# EAGLE design uRings_SE_Main_Board (EAGLE 9.6.2)
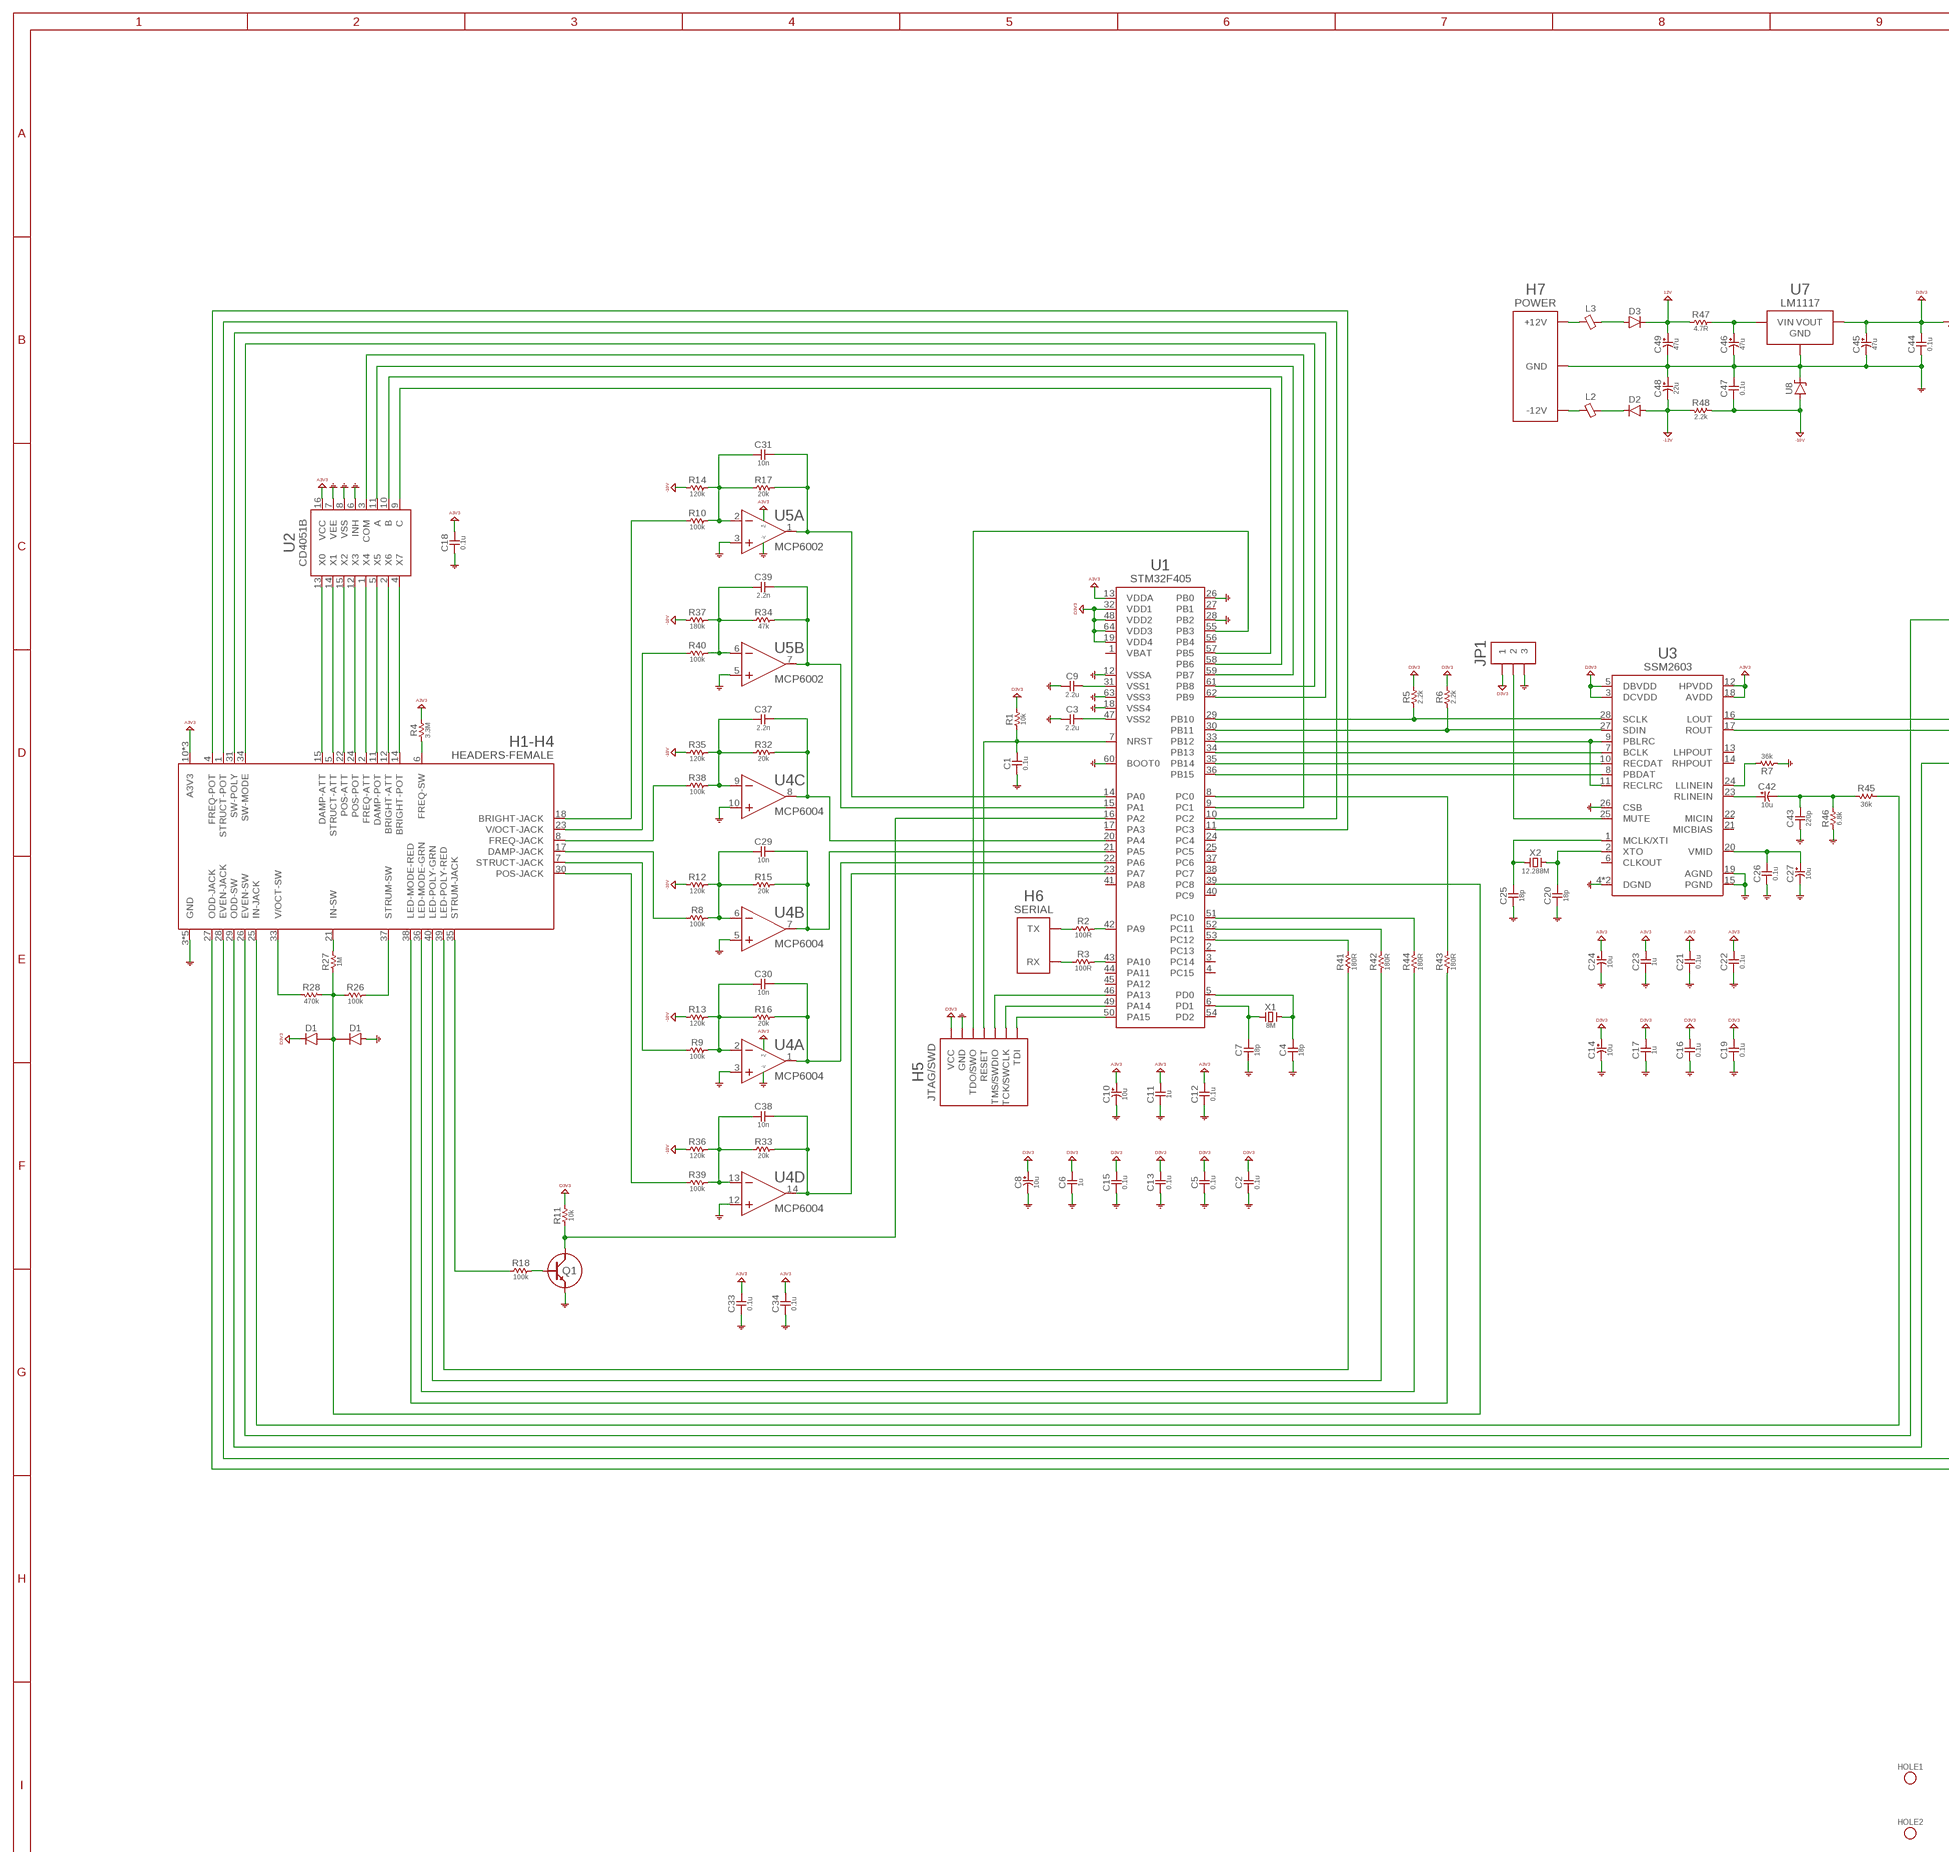
[diagram p0: schematic, sheet 1, part 1 of 2]
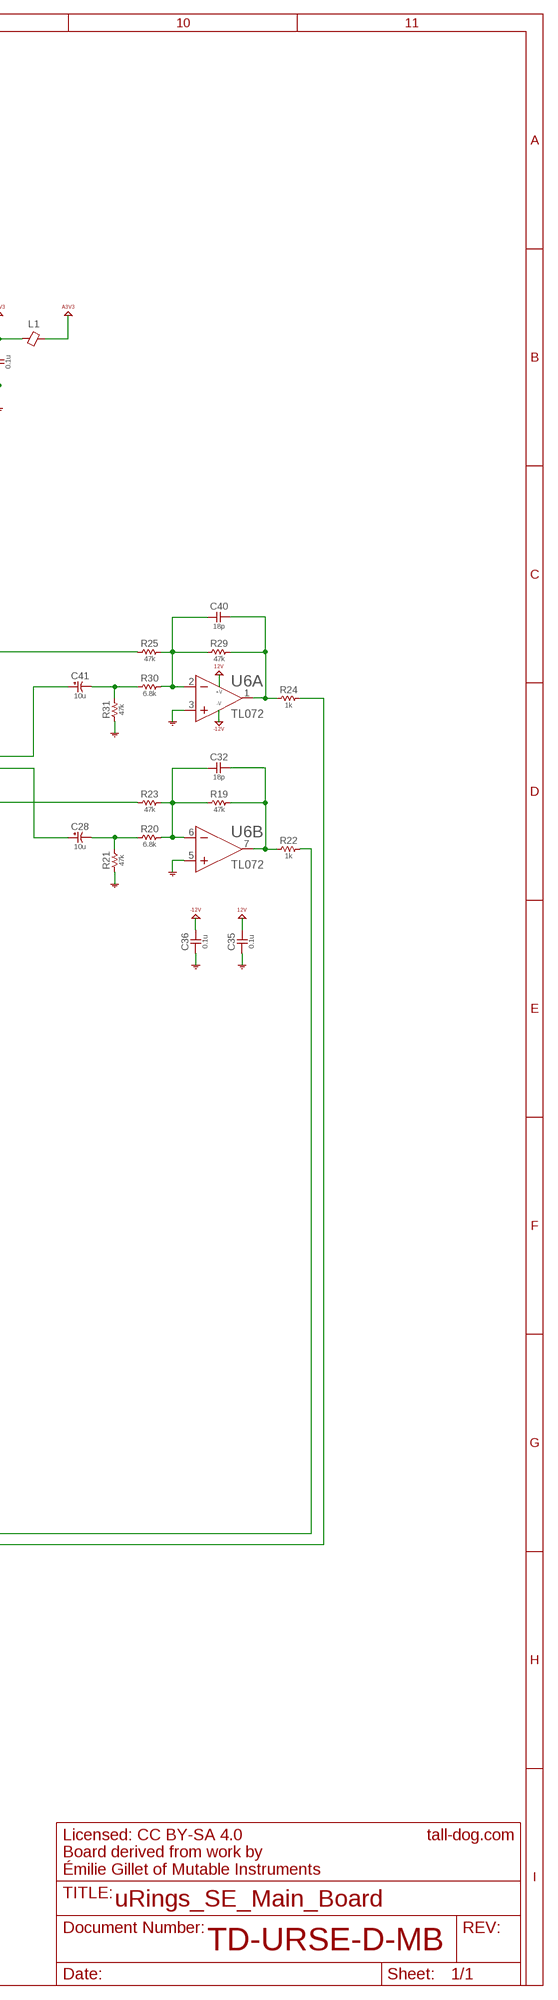
[diagram p1: schematic, sheet 1, part 2 of 2]

## Parts
C1  0.1u  CAP-NP-0603  [0603-NP]
C2  0.1u  CAP-NP-0603  [0603-NP]
C3  2.2u  CAP-NP-0603  [0603-NP]
C4  18p  CAP-NP-0603  [0603-NP]
C5  0.1u  CAP-NP-0603  [0603-NP]
C6  1u  CAP-NP-0603  [0603-NP]
C7  18p  CAP-NP-0603  [0603-NP]
C8  10u  CAP-P-4.3MM  [ELECTRO-SMD-4.3MM]
C9  2.2u  CAP-NP-0603  [0603-NP]
C10  10u  CAP-P-4.3MM  [ELECTRO-SMD-4.3MM]
C11  1u  CAP-NP-0603  [0603-NP]
C12  0.1u  CAP-NP-0603  [0603-NP]
C13  0.1u  CAP-NP-0603  [0603-NP]
C14  10u  CAP-P-4.3MM  [ELECTRO-SMD-4.3MM]
C15  0.1u  CAP-NP-0603  [0603-NP]
C16  0.1u  CAP-NP-0603  [0603-NP]
C17  1u  CAP-NP-0603  [0603-NP]
C18  0.1u  CAP-NP-0603  [0603-NP]
C19  0.1u  CAP-NP-0603  [0603-NP]
C20  18p  CAP-NP-0603  [0603-NP]
C21  0.1u  CAP-NP-0603  [0603-NP]
C22  0.1u  CAP-NP-0603  [0603-NP]
C23  1u  CAP-NP-0603  [0603-NP]
C24  10u  CAP-P-4.3MM  [ELECTRO-SMD-4.3MM]
C25  18p  CAP-NP-0603  [0603-NP]
C26  0.1u  CAP-NP-0603  [0603-NP]
C27  10u  CAP-P-4.3MM  [ELECTRO-SMD-4.3MM]
C28  10u  CAP-P-4.3MM  [ELECTRO-SMD-4.3MM]
C29  10n  CAP-NP-0603  [0603-NP]
C30  10n  CAP-NP-0603  [0603-NP]
C31  10n  CAP-NP-0603  [0603-NP]
C32  18p  CAP-NP-0603  [0603-NP]
C33  0.1u  CAP-NP-0603  [0603-NP]
C34  0.1u  CAP-NP-0603  [0603-NP]
C35  0.1u  CAP-NP-0603  [0603-NP]
C36  0.1u  CAP-NP-0603  [0603-NP]
C37  2.2n  CAP-NP-0603  [0603-NP]
C38  10n  CAP-NP-0603  [0603-NP]
C39  2.2n  CAP-NP-0603  [0603-NP]
C40  18p  CAP-NP-0603  [0603-NP]
C41  10u  CAP-P-4.3MM  [ELECTRO-SMD-4.3MM]
C42  10u  CAP-P-4.3MM  [ELECTRO-SMD-4.3MM]
C43  220p  CAP-NP-0603  [0603-NP]
C44  0.1u  CAP-NP-0603  [0603-NP]
C45  47u  CAP-P-6.6MM  [ELECTRO-SMD-6.6MM]
C46  47u  CAP-P-6.6MM  [ELECTRO-SMD-6.6MM]
C47  0.1u  CAP-NP-0603  [0603-NP]
C48  22u  CAP-P-6.6MM  [ELECTRO-SMD-6.6MM]
C49  47u  CAP-P-6.6MM  [ELECTRO-SMD-6.6MM]
D1  DIODE-DUAL  [SOT-23]
D2  DIODE  [SOD-123]
D3  DIODE  [SOD-123]
H1-H4  HEADERS-FEMALE  [HEADERS-FEMALE]
H5  JTAG/SWD  [PTH-0.05-2X5-SHROUDED]
H6  SERIAL  [SERIAL]
H7  POWER  [PTH-0.1-2X5-SHROUDED]
HOLE1  HOLE  [M2.5-HOLE]
HOLE2  HOLE  [M2.5-HOLE]
JP1  JUMPER-3  [JUMPER-3]
L1  FERRITE-BEAD-0603  [0603-NP]
L2  FERRITE-BEAD-0603  [0603-NP]
L3  FERRITE-BEAD-0603  [0603-NP]
Q1  NPN  [SOT-23]
R1  10k  RESISTOR-0603  [0603-NP]
R2  100R  RESISTOR-0603  [0603-NP]
R3  100R  RESISTOR-0603  [0603-NP]
R4  3.3M  RESISTOR-1206  [1206-NP]
R5  2.2k  RESISTOR-0603  [0603-NP]
R6  2.2k  RESISTOR-0603  [0603-NP]
R7  36k  RESISTOR-0603  [0603-NP]
R8  100k  RESISTOR-0603  [0603-NP]
R9  100k  RESISTOR-0603  [0603-NP]
R10  100k  RESISTOR-0603  [0603-NP]
R11  10k  RESISTOR-0603  [0603-NP]
R12  120k  RESISTOR-0603  [0603-NP]
R13  120k  RESISTOR-0603  [0603-NP]
R14  120k  RESISTOR-0603  [0603-NP]
R15  20k  RESISTOR-0603  [0603-NP]
R16  20k  RESISTOR-0603  [0603-NP]
R17  20k  RESISTOR-0603  [0603-NP]
R18  100k  RESISTOR-0603  [0603-NP]
R19  47k  RESISTOR-0603  [0603-NP]
R20  6.8k  RESISTOR-0603  [0603-NP]
R21  47k  RESISTOR-0603  [0603-NP]
R22  1k  RESISTOR-0603  [0603-NP]
R23  47k  RESISTOR-0603  [0603-NP]
R24  1k  RESISTOR-0603  [0603-NP]
R25  47k  RESISTOR-0603  [0603-NP]
R26  100k  RESISTOR-0603  [0603-NP]
R27  1M  RESISTOR-1206  [1206-NP]
R28  470k  RESISTOR-1206  [1206-NP]
R29  47k  RESISTOR-0603  [0603-NP]
R30  6.8k  RESISTOR-0603  [0603-NP]
R31  47k  RESISTOR-0603  [0603-NP]
R32  20k  RESISTOR-0603  [0603-NP]
R33  20k  RESISTOR-0603  [0603-NP]
R34  47k  RESISTOR-0603  [0603-NP]
R35  120k  RESISTOR-0603  [0603-NP]
R36  120k  RESISTOR-0603  [0603-NP]
R37  180k  RESISTOR-0603  [0603-NP]
R38  100k  RESISTOR-0603  [0603-NP]
R39  100k  RESISTOR-0603  [0603-NP]
R40  100k  RESISTOR-0603  [0603-NP]
R41  180R  RESISTOR-0603  [0603-NP]
R42  180R  RESISTOR-0603  [0603-NP]
R43  180R  RESISTOR-0603  [0603-NP]
R44  180R  RESISTOR-0603  [0603-NP]
R45  36k  RESISTOR-0603  [0603-NP]
R46  6.8k  RESISTOR-0603  [0603-NP]
R47  4.7R  RESISTOR-1206  [1206-NP]
R48  2.2k  RESISTOR-0603  [0603-NP]
U1  STM32F405  [LQFP-64]
U2  CD4051B  [TSSOP-16]
U3  SSM2603  [QFN-28]
U4  MCP6004  [TSSOP-14]
U5  MCP6002  [MSOP-8]
U6  TL072  [TSSOP-8]
U7  LM1117  [SOT-223]
U8  ZENER  [SOT-23]
X1  8M  CRYSTAL  [CRYSTAL-ABM3]
X2  12.288M  CRYSTAL  [CRYSTAL-ABM3]

## Nets
12V: C35.2 C49.A(POS) D3.C R47.1 U6.8(A:POS)
-10V: C47.2 R12.1 R13.1 R14.1 R35.1 R36.1 R37.1 R48.1 U8.2(A)
-12V: C36.1 C48.C(NEG) D2.A R48.2 U6.4(A:NEG)
A3V3: C10.A(POS) C11.2 C12.2 C18.2 C21.2 C22.2 C23.2 C24.A(POS) C33.2 C34.2 H1-H4.10(A3V3) H1-H4.16(A3V3) H1-H4.20(A3V3) L1.2 R4.2 U1.13(VDDA) U2.16(VCC) U3.12(HPVDD) U3.18(AVDD) U4.4(A:POS) U5.8(A:POS)
BRIGHT-ATT: H1-H4.12(BRIGHT-ATT) U2.2(X6)
BRIGHT-CV: C31.2 R17.2 U1.14(PA0) U5.1(A:OUT)
BRIGHT-JACK: H1-H4.18(BRIGHT-JACK) R10.1
BRIGHT-POT: H1-H4.14(BRIGHT-POT) U2.4(X7)
D3V3: C2.2 C5.2 C6.2 C8.A(POS) C13.2 C14.A(POS) C15.2 C16.2 C17.2 C19.2 C44.2 C45.A(POS) D1.2(C2) H5.1(VCC) JP1.1 L1.1 R1.2 R5.2 R6.2 R11.2 U1.19(VDD4) U1.32(VDD1) U1.48(VDD2) U1.64(VDD3) U3.3(DCVDD) U3.5(DBVDD) U7.2(VOUT) U7.4(VOUT)
DAMP-ATT: H1-H4.15(DAMP-ATT) U2.13(X0)
DAMP-CV: C29.2 R15.2 U1.21(PA5) U4.7(B:OUT)
DAMP-JACK: H1-H4.17(DAMP-JACK) R8.1
DAMP-POT: H1-H4.11(DAMP-POT) U2.5(X5)
EVEN-JACK: H1-H4.28(EVEN-JACK) R22.2
EVEN-OUT: C28.A(POS) U3.17(ROUT)
EVEN-SW: H1-H4.26(EVEN-SW) R25.1
FREQ-ATT: H1-H4.2(FREQ-ATT) U2.1(X4)
FREQ-CV: C37.2 R32.2 U1.20(PA4) U4.8(C:OUT)
FREQ-JACK: H1-H4.8(FREQ-JACK) R38.1
FREQ-POT: H1-H4.4(FREQ-POT) U1.11(PC3)
GND: C1.1 C2.1 C3.1 C4.2 C5.1 C6.1 C7.2 C8.C(NEG) C9.1 C10.C(NEG) C11.1 C12.1 C13.1 C14.C(NEG) C15.1 C16.1 C17.1 C18.1 C19.1 C20.1 C21.1 C22.1 C23.1 C24.C(NEG) C25.1 C26.1 C27.C(NEG) C33.1 C34.1 C35.1 C36.2 C43.1 C44.1 C45.C(NEG) C46.C(NEG) C47.1 C48.A(POS) C49.C(NEG) D1.1(A1) H1-H4.3(GND) H1-H4.9(GND) H1-H4.13(GND) H1-H4.19(GND) H1-H4.32(GND) H5.3(GND) H5.5(GND) H5.9(GND) H7.3(GND) H7.4(GND) H7.5(GND) H7.6(GND) H7.7(GND) H7.8(GND) JP1.3 Q1.2(E) R7.1 R21.1 R31.1 R46.1 U1.12(VSSA) U1.18(VSS4) U1.26(PB0) U1.28(PB2) U1.60(BOOT0) U1.63(VSS3) U2.6(INH) U2.7(VEE) U2.8(VSS) U3.4(DGND) U3.15(PGND) U3.19(AGND) U3.26(CSB) U3.29(DGND) U4.3(A:IN+) U4.5(B:+) U4.10(C:+) U4.11(A:NEG) U4.12(D:+) U5.3(A:IN+) U5.4(A:NEG) U5.5(B:+) U6.3(A:IN+) U6.5(B:+) U7.1(GND) U8.1(C)
I2C-SCL: R5.1 U1.29(PB10) U3.28(SCLK)
I2C-SDA: R6.1 U1.30(PB11) U3.27(SDIN)
I2S-LRCK: U1.33(PB12) U3.9(PBLRC) U3.11(RECLRC)
I2S-SCK: U1.34(PB13) U3.7(BCLK)
I2S-SIN: U1.35(PB14) U3.10(RECDAT)
I2S-SOUT: U1.36(PB15) U3.8(PBDAT)
IN: C42.A(POS) U3.23(RLINEIN)
IN-JACK: H1-H4.25(IN-JACK) R45.1
IN-SW: H1-H4.21(IN-SW) R27.2
JTCK/SWCLK: H5.4(TCK/SWCLK) U1.49(PA14)
JTDI: H5.8(TDI) U1.50(PA15)
JTDO/SWO: H5.6(TDO/SWO) U1.55(PB3)
JTMS/SWDIO: H5.2(TMS/SWDIO) U1.46(PA13)
LED-MODE-GRN: H1-H4.36(LED-MODE-GRN) R44.2
LED-MODE-RED: H1-H4.38(LED-MODE-RED) R43.2
LED-POLY-GRN: H1-H4.40(LED-POLY-GRN) R42.2
LED-POLY-RED: H1-H4.39(LED-POLY-RED) R41.2
MUTE: JP1.2 U3.25(MUTE)
MUX-ADDR-0: U1.59(PB7) U2.11(A)
MUX-ADDR-1: U1.58(PB6) U2.10(B)
MUX-ADDR-2: U1.57(PB5) U2.9(C)
MUXED-POTS: U1.9(PC1) U2.3(COM)
N$1: R43.1 U1.8(PC0)
N$2: C46.A(POS) R47.2 U7.3(VIN)
N$3: D3.A L3.1
N$4: D2.C L2.1
N$5: C29.1 R8.2 R12.2 R15.1 U4.6(B:-)
N$6: R44.1 U1.51(PC10)
N$7: C9.2 U1.31(VSS1)
N$8: C3.2 U1.47(VSS2)
N$9: R42.1 U1.52(PC11)
N$10: R41.1 U1.53(PC12)
N$11: C4.1 U1.5(PD0) X1.2
N$12: C7.1 U1.6(PD1) X1.1
N$13: C31.1 R10.2 R14.2 R17.1 U5.2(A:IN-)
N$14: C39.1 R34.1 R37.2 R40.2 U5.6(B:-)
N$15: C37.1 R32.1 R35.2 R38.2 U4.9(C:-)
N$16: C30.1 R9.2 R13.2 R16.1 U4.2(A:IN-)
N$17: C38.1 R33.1 R36.2 R39.2 U4.13(D:-)
N$18: C28.C(NEG) R20.1 R21.2
N$19: C42.C(NEG) C43.2 R45.2 R46.2
N$20: C41.C(NEG) R30.1 R31.2
N$21: Q1.1(B) R18.2
N$22: C25.2 U3.1(MCLK/XTI) X2.2
N$23: C20.2 U3.2(XTO) X2.1
N$24: C32.1 R19.1 R20.2 R23.2 U6.6(B:-)
N$25: C32.2 R19.2 R22.1 U6.7(B:OUT)
N$26: C40.1 R25.2 R29.1 R30.2 U6.2(A:IN-)
N$27: C26.2 C27.A(POS) U3.20(VMID)
N$28: R7.2 U3.24(LLINEIN)
N$29: C40.2 R24.1 R29.2 U6.1(A:OUT)
N$30: H1-H4.6(FREQ-SW) R4.1
N$100: H7.1(-12V) H7.2(-12V) L2.2
N$101: H7.9(+12V) H7.10(+12V) L3.2
NORM-PROBE: D1.3(C1/A2) R26.1 R27.1 R28.1 U1.39(PC8)
ODD-JACK: H1-H4.27(ODD-JACK) R24.2
ODD-OUT: C41.A(POS) U3.16(LOUT)
ODD-SW: H1-H4.29(ODD-SW) R23.1
POS-ATT: H1-H4.22(POS-ATT) U2.15(X2)
POS-CV: C38.2 R33.2 U1.23(PA7) U4.14(D:OUT)
POS-JACK: H1-H4.30(POS-JACK) R39.1
POS-POT: H1-H4.24(POS-POT) U2.12(X3)
RESET: C1.2 H5.10(RESET) R1.1 U1.7(NRST)
RX: H6.RX R3.1
RX1: R3.2 U1.43(PA10)
STRUCT-ATT: H1-H4.5(STRUCT-ATT) U2.14(X1)
STRUCT-CV: C30.2 R16.2 U1.22(PA6) U4.1(A:OUT)
STRUCT-JACK: H1-H4.7(STRUCT-JACK) R9.1
STRUCT-POT: H1-H4.1(STRUCT-POT) U1.10(PC2)
STRUM: Q1.3(C) R11.1 U1.16(PA2)
STRUM-JACK: H1-H4.35(STRUM-JACK) R18.1
STRUM-SW: H1-H4.37(STRUM-SW) R26.2
SW-MODE: H1-H4.34(SW-MODE) U1.61(PB8)
SW-POLY: H1-H4.31(SW-POLY) U1.62(PB9)
TX: H6.TX R2.1
TX1: R2.2 U1.42(PA9)
V/OCT-CV: C39.2 R34.2 U1.15(PA1) U5.7(B:OUT)
V/OCT-JACK: H1-H4.23(V/OCT-JACK) R40.1
V/OCT-SW: H1-H4.33(V/OCT-SW) R28.2
Unconnected: HOLE1.P$1 HOLE1.P$2 HOLE1.P$3 HOLE1.P$4 HOLE1.P$5 HOLE1.P$6 HOLE1.P$7 HOLE1.P$8 HOLE1.P$9 HOLE2.P$1 HOLE2.P$2 HOLE2.P$3 HOLE2.P$4 HOLE2.P$5 HOLE2.P$6 HOLE2.P$7 HOLE2.P$8 HOLE2.P$9 U1.1(VBAT) U1.2(PC13) U1.3(PC14) U1.4(PC15) U1.17(PA3) U1.24(PC4) U1.25(PC5) U1.27(PB1) U1.37(PC6) U1.38(PC7) U1.40(PC9) U1.41(PA8) U1.44(PA11) U1.45(PA12) U1.54(PD2) U1.56(PB4) U3.6(CLKOUT) U3.13(LHPOUT) U3.14(RHPOUT) U3.21(MICBIAS) U3.22(MICIN)

## Notes on the sheet
- tall-dog.com
- Licensed: CC BY-SA 4.0
  Board derived from work by
  Émilie Gillet of Mutable Instruments
- TD-URSE-D-MB

## Library data of the parts
C1-C7 C9 C11-C13 C15-C23 C25 C26 C29-C40 C43 C44 C47 = uRings_SE_Library:CAP-NP
C8 C10 C14 C24 C27 C28 C41 C42 C45 C46 C48 C49 = uRings_SE_Library:CAP-P
D1 = uRings_SE_Library:DIODE-DUAL
D2 D3 = uRings_SE_Library:DIODE
H1-H4 = uRings_SE_Library:HEADERS-FEMALE
H5 = uRings_SE_Library:JTAG/SWD
H6 = uRings_SE_Library:SERIAL
H7 = uRings_SE_Library:POWER
HOLE1 HOLE2 = uRings_SE_Library:HOLE
JP1 = uRings_SE_Library:JUMPER-3
L1-L3 = uRings_SE_Library:FERRITE-BEAD
Q1 = uRings_SE_Library:NPN
R1-R48 = uRings_SE_Library:RESISTOR
U1 = uRings_SE_Library:STM32F405
U2 = uRings_SE_Library:CD4051B
U3 = uRings_SE_Library:SSM2603
U4 = uRings_SE_Library:MCP6004
U5 = uRings_SE_Library:MCP6002
U6 = uRings_SE_Library:TL072: OP AMP
U7 = uRings_SE_Library:LM1117: 800mA and 1A Low Dropout (LDO) Positive Regulator 1.8V, 2.5V, 2.85V, 3.3V, 5V, and Adj
U8 = uRings_SE_Library:ZENER: PRECISION MICROPOWER SHUNT VOLTAGE REFERENCE Source: http://focus.ti.com/lit/ds/slcs146e/slcs146e.pdf
X1 X2 = uRings_SE_Library:CRYSTAL

## Board
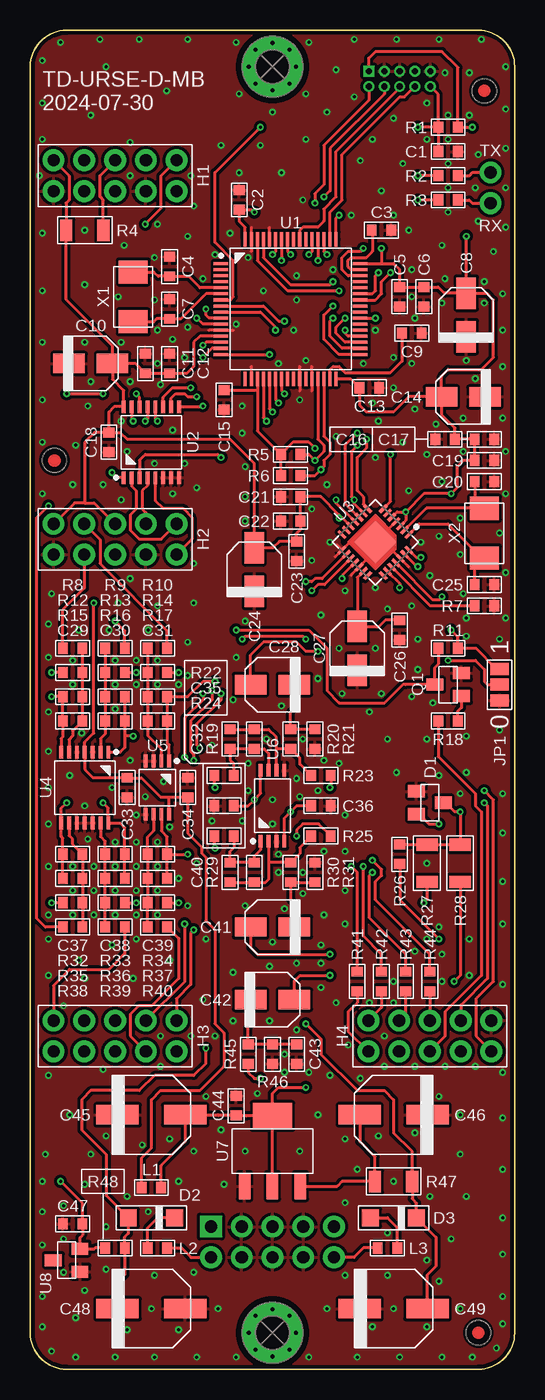
[diagram p2: board, top side]
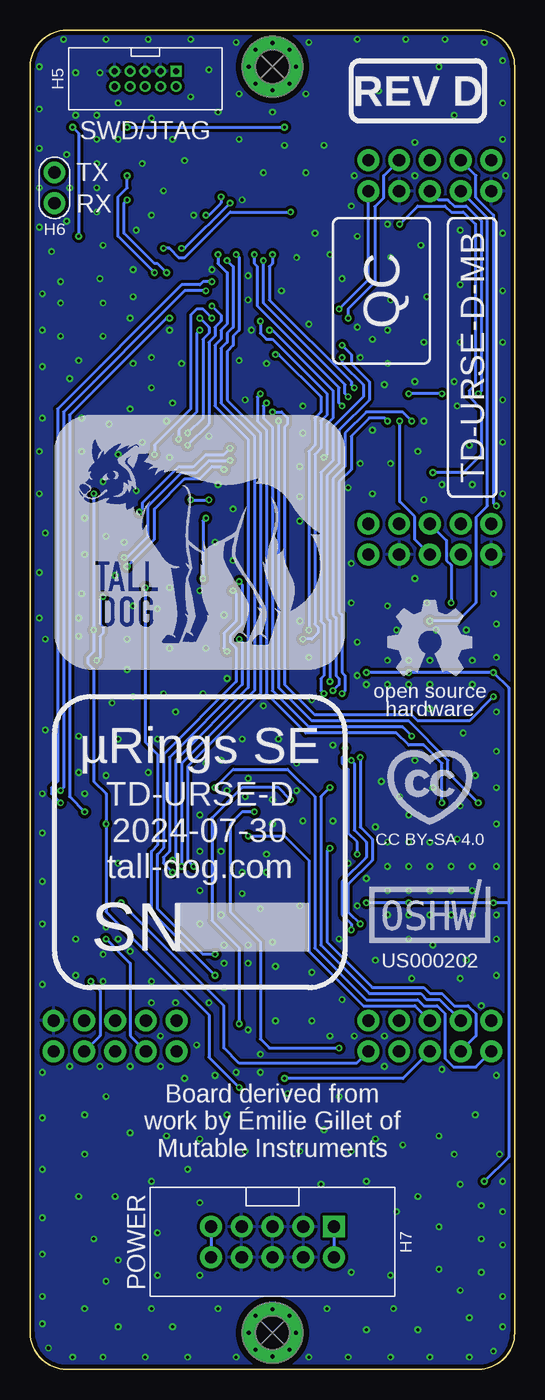
[diagram p3: board, bottom side, seen from below]

Size 40 x 110.5 mm. Coordinates in mm from the lower left corner, seen from the top.
Outline: 3,0 37,0 arc90 40,3 40,107.5 arc90 37,110.5 3,110.5 arc90 0,107.5 0,3 arc90 3,0
Copper layers (1*16): Top 0.035mm / dielectric 1.5mm / Bottom 0.035mm
Design rules "brds *": minimum track width 0.25mm, minimum drill 0.25mm, track to track 6mil, track to pad 6mil, pad to pad 6mil, via to via 6mil, smd to smd 0mil, copper to edge 12mil, drill to drill 8mil, minimum pad ring 6mil, minimum via ring 6mil, stop-mask expansion 0mil, vias tented up to drill 0.3mm, thermal gap 10mil

### Footprints (pad centres in the part's own frame; a part is rotated, then mirrored left to right if it is on the bottom)
0603-NP = smd 0.81 x 0.93: 1 -0.81,0; 2 0.81,0
ELECTRO-SMD-4.3MM = smd 2.6 x 1.6: A 1.8,0; C -1.8,0
ELECTRO-SMD-6.6MM = smd 3.5 x 1.6: A 2.8,0; C -2.8,0
SOT-23 = smd 1 x 1.4: 1 -0.95,-1.1; 2 0.95,-1.1; 3 0,1.1
SOD-123 = smd 1.4 x 1.4: A 1.9,0; C -1.9,0
HEADERS-FEMALE = drill 1 pad 1.8: 1 12.08,97.23; 2 12.08,99.77; 3 9.54,97.23; 4 9.54,99.77; 5 7,97.23; 6 7,99.77; 7 4.46,97.23; 8 4.46,99.77; 9 1.92,97.23; 10 1.92,99.77; 11 12.08,67.23; 12 12.08,69.77; 13 9.54,67.23; 14 9.54,69.77; 15 7,67.23; 16 7,69.77; 17 4.46,67.23; 18 4.46,69.77; 19 1.92,67.23; 20 1.92,69.77; 21 12.08,26.23; 22 12.08,28.77; 23 9.54,26.23; 24 9.54,28.77; 25 7,26.23; 26 7,28.77; 27 4.46,26.23; 28 4.46,28.77; 29 1.92,26.23; 30 1.92,28.77; 31 38.08,26.23; 32 38.08,28.77; 33 35.54,26.23; 34 35.54,28.77; 35 33,26.23; 36 33,28.77; 37 30.46,26.23; 38 30.46,28.77; 39 27.92,26.23; 40 27.92,28.77
PTH-0.05-2X5-SHROUDED = drill 0.5 pad 0.9 square: 1 -0.635,2.54 | drill 0.5 pad 0.9: 2 0.635,2.54; 3 -0.635,1.27; 4 0.635,1.27; 5 -0.635,0; 6 0.635,0; 7 -0.635,-1.27; 8 0.635,-1.27; 9 -0.635,-2.54; 10 0.635,-2.54
SERIAL = drill 1.016 pad 1.778: RX 0,-1.27; TX 0,1.27
PTH-0.1-2X5-SHROUDED = drill 1 pad 1.8 square: 1 -1.27,5.08 | drill 1 pad 1.8: 2 1.27,5.08; 3 -1.27,2.54; 4 1.27,2.54; 5 -1.27,0; 6 1.27,0; 7 -1.27,-2.54; 8 1.27,-2.54; 9 -1.27,-5.08; 10 1.27,-5.08
M2.5-HOLE = drill 2.75 pad 5: P$1 0,0 | drill 0.35: P$2 0,1.95; P$3 0,-1.95; P$4 -1.95,0; P$5 1.95,0; P$6 1.4,1.4; P$7 -1.4,1.4; P$8 -1.4,-1.4; P$9 1.4,-1.4
JUMPER-3 = smd 1 x 1.5: 1 -1.3,0; 2 0,0; 3 1.3,0
1206-NP = smd 1 x 1.77: 1 -1.535,0; 2 1.535,0
LQFP-64 = smd 0.25 x 1.2: 1 -3.75,-5.75; 2 -3.25,-5.75; 3 -2.75,-5.75; 4 -2.25,-5.75; 5 -1.75,-5.75; 6 -1.25,-5.75; 7 -0.75,-5.75; 8 -0.25,-5.75; 9 0.25,-5.75; 10 0.75,-5.75; 11 1.25,-5.75; 12 1.75,-5.75; 13 2.25,-5.75; 14 2.75,-5.75; 15 3.25,-5.75; 16 3.75,-5.75; 33 3.75,5.75; 34 3.25,5.75; 35 2.75,5.75; 36 2.25,5.75; 37 1.75,5.75; 38 1.25,5.75; 39 0.75,5.75; 40 0.25,5.75; 41 -0.25,5.75; 42 -0.75,5.75; 43 -1.25,5.75; 44 -1.75,5.75; 45 -2.25,5.75; 46 -2.75,5.75; 47 -3.25,5.75; 48 -3.75,5.75 | smd 1.2 x 0.25: 17 5.75,-3.75; 18 5.75,-3.25; 19 5.75,-2.75; 20 5.75,-2.25; 21 5.75,-1.75; 22 5.75,-1.25; 23 5.75,-0.75; 24 5.75,-0.25; 25 5.75,0.25; 26 5.75,0.75; 27 5.75,1.25; 28 5.75,1.75; 29 5.75,2.25; 30 5.75,2.75; 31 5.75,3.25; 32 5.75,3.75; 49 -5.75,3.75; 50 -5.75,3.25; 51 -5.75,2.75; 52 -5.75,2.25; 53 -5.75,1.75; 54 -5.75,1.25; 55 -5.75,0.75; 56 -5.75,0.25; 57 -5.75,-0.25; 58 -5.75,-0.75; 59 -5.75,-1.25; 60 -5.75,-1.75; 61 -5.75,-2.25; 62 -5.75,-2.75; 63 -5.75,-3.25; 64 -5.75,-3.75
TSSOP-16 = smd 0.32 x 1.05: 1 -2.275,-2.925; 2 -1.625,-2.925; 3 -0.975,-2.925; 4 -0.325,-2.925; 5 0.325,-2.925; 6 0.975,-2.925; 7 1.625,-2.925; 8 2.275,-2.925; 9 2.275,2.925; 10 1.625,2.925; 11 0.975,2.925; 12 0.325,2.925; 13 -0.325,2.925; 14 -0.975,2.925; 15 -1.625,2.925; 16 -2.275,2.925
QFN-28 = smd 0.813 x 0.254: 1 -2.4,1.5; 2 -2.4,1; 3 -2.4,0.5; 4 -2.4,0; 5 -2.4,-0.5; 6 -2.4,-1; 7 -2.4,-1.5; 15 2.4,-1.5; 16 2.4,-1; 17 2.4,-0.5; 18 2.4,0; 19 2.4,0.5; 20 2.4,1; 21 2.4,1.5 | smd 0.254 x 0.813: 8 -1.5,-2.4; 9 -1,-2.4; 10 -0.5,-2.4; 11 0,-2.4; 12 0.5,-2.4; 13 1,-2.4; 14 1.5,-2.4; 22 1.5,2.4; 23 1,2.4; 24 0.5,2.4; 25 0,2.4; 26 -0.5,2.4; 27 -1,2.4; 28 -1.5,2.4 | smd 2.45 x 2.45: 29 0,0
TSSOP-14 = smd 0.32 x 1.05: 1 -1.95,-2.925; 2 -1.3,-2.925; 3 -0.65,-2.925; 4 0,-2.925; 5 0.65,-2.925; 6 1.3,-2.925; 7 1.95,-2.925; 8 1.95,2.925; 9 1.3,2.925; 10 0.65,2.925; 11 0,2.925; 12 -0.65,2.925; 13 -1.3,2.925; 14 -1.95,2.925
MSOP-8 = smd 0.32 x 1.05: 1 -0.975,-2.2; 2 -0.325,-2.2; 3 0.325,-2.2; 4 0.975,-2.2; 5 0.975,2.2; 6 0.325,2.2; 7 -0.325,2.2; 8 -0.975,2.2
TSSOP-8 = smd 0.32 x 1.05: 1 -0.975,-2.925; 2 -0.325,-2.925; 3 0.325,-2.925; 4 0.975,-2.925; 5 0.975,2.925; 6 0.325,2.925; 7 -0.325,2.925; 8 -0.975,2.925
SOT-223 = smd 0.95 x 2.15: 1 -2.3,-2.9; 2 0,-2.9; 3 2.3,-2.9 | smd 3.25 x 2.15: 4 0,2.9
CRYSTAL-ABM3 = smd 1.9 x 2.4: 1 -2.05,0; 2 2.05,0

### Placement (x,y rotation side)
C1  34.5,100.5 180 top
C2  17.25,96.5 270 top
C3  29,94 180 top
C4  11.5,91 90 top
C5  30.5,88.5 90 top
C6  32.5,88.5 90 top
C7  11.5,87.5 90 top
C8  36,87 90 top
C9  31.5,85.5 180 top
C10  5,83 0 top
C11  9.5,83 270 top
C12  11.5,83 270 top
C13  28,81 180 top
C14  35.75,80.25 180 top
C15  16,80 90 top
C16  34.25,76.75 0 top
C17  37.5,76.75 180 top
C18  6.5,76.5 90 top
C19  37.5,75 180 top
C20  37.5,73.25 180 top
C21  21.5,72 0 top
C22  21.5,70 0 top
C23  22,67.5 90 top
C24  18.5,66 90 top
C25  37.5,64.75 180 top
C26  30.5,61 90 top
C27  27,59.5 90 top
C28  20,56.5 180 top
C29  3.5,53.5 180 top
C30  7,53.5 0 top
C31  10.5,53.5 0 top
C32  16.5,52 270 top
C33  8,48 90 top
C34  13,48 270 top
C35  16,46.5 0 top
C36  24,46.5 0 top
C37  3.5,42.5 180 top
C38  7,42.5 0 top
C39  10.5,42.5 0 top
C40  16.5,41 90 top
C41  20,36.5 180 top
C42  20,30.5 0 top
C43  22,26 90 top
C44  17,21.75 270 top
C45  10,21 0 top
C46  30,21 180 top
C47  3.5,12 0 top
C48  10,5 0 top
C49  30,5 0 top
D1  33,46.75 270 top
D2  10,12.5 180 top
D3  30,12.5 180 top
H1-H4  0,0 0 top
H5  30.5,106.5 270 bottom
H6  38,97.5 0 bottom
H7  20,10.5 270 bottom
HOLE1  20,107.5 0 top
HOLE2  20,3 0 top
JP1  38.75,56.5 270 top
L1  10,15 180 top
L2  10.5,10 0 top
L3  29.5,10 180 top
Q1  34.5,56.5 90 top
R1  34.5,102.5 0 top
R2  34.5,98.5 180 top
R3  34.5,96.5 180 top
R4  4.5,94 180 top
R5  21.5,75.5 180 top
R6  21.5,73.75 180 top
R7  37.5,63 180 top
R8  3.5,59.5 0 top
R9  7,59.5 180 top
R10  10.5,59.5 180 top
R11  34.5,59.5 0 top
R12  3.5,57.5 0 top
R13  7,57.5 180 top
R14  10.5,57.5 180 top
R15  3.5,55.5 180 top
R16  7,55.5 0 top
R17  10.5,55.5 0 top
R18  34.5,53.5 0 top
R19  18.5,52 270 top
R20  21.5,52 270 top
R21  23.5,52 90 top
R22  16,49 180 top
R23  24,49 180 top
R24  16,44 180 top
R25  24,44 180 top
R26  30.5,42.5 270 top
R27  32.75,41.75 270 top
R28  35.5,41.75 270 top
R29  18.5,41 90 top
R30  21.5,41 90 top
R31  23.5,41 270 top
R32  3.5,40.5 180 top
R33  7,40.5 0 top
R34  10.5,40.5 0 top
R35  3.5,38.5 0 top
R36  7,38.5 180 top
R37  10.5,38.5 180 top
R38  3.5,36.5 0 top
R39  7,36.5 180 top
R40  10.5,36.5 180 top
R41  27,32 270 top
R42  29,32 270 top
R43  31,32 270 top
R44  33,32 270 top
R45  18,26 90 top
R46  20,26 90 top
R47  30,15.5 180 top
R48  7,10 0 top
U1  21.5,87.5 270 top
U2  10,76.5 0 top
U3  28.5,68.25 225 top
U4  4.5,48 180 top
U5  10.5,48 180 top
U6  20,46.5 0 top
U7  20,18 0 top
U8  3,9 90 top
U$1  [LOGO-PN]  3.5,83.5 90 bottom
U$2  [FIDUCIAL]  37.5,105.5 0 top
U$3  [LOGO-CC]  7,48 0 bottom
U$4  [LOGO-OSH]  7,60 0 bottom
U$5  [FIDUCIAL]  2,75 0 top
U$6  [FIDUCIAL]  37,3 0 top
U$7  [LOGO-SN]  26,44.5 0 bottom
U$8  [LOGO-OSHW]  7,37.5 0 bottom
U$9  [LOGO-TD]  26,68.25 0 bottom
U$10  [LOGO-REV]  8,105.5 0 bottom
U$11  [LOGO-QC]  11,89 270 bottom
X1  8.5,88.5 90 top
X2  37.5,69 270 top

### Tracks (layer width: path | path; a pad name or v marks a point on that pad's centre or on a via)
12V  (via drill 0.25)
  Top 0.25: C35.2 18,46.5 v18.5,47 19.02,47.52 U6.8 | v22.75,28.5 24,27.25 24,26 27,23 29.25,23 30,22.25 30,19.5 31.54,17.96 R47.1 31.54,14.06 31.9,13.7 D3.C 33.5,10.9 33.5,8.5 32.8,7.8 C49.A
  Bottom 0.25: v18.5,47 19.5,48 22.5,48 25,45.5 25,37 22.75,34.75 v22.75,28.5
-10V  (via drill 0.25)
  Top 0.25: R13.1 v8.75,57.5 | R14.1 v12.25,57.5 | R35.1 v1.75,38.5 | R37.1 v12.25,38.5 | R48.1 5.35,10 5.3,9.95 U8.2 4.1,10.85 4.31,11.06 C47.2 4.31,13.69 v2.5,15.5 | R12.1 v1.75,57.5 | R36.1 v8.75,38.5
  Bottom 0.25: v12.25,57.5 v8.75,57.5 v1.75,57.5 0.5,56.25 0.5,38.5 | v12.25,38.5 v8.75,38.5 v1.75,38.5 0.5,38.5 | 0.5,38.5 0.5,17.5 v2.5,15.5
-12V  (via drill 0.25)
  Top 0.25: C36.1 22,46.5 v21.5,46 20.98,45.48 U6.4 | v14.5,26.5 14.5,25.25 13.5,24.25 10.25,24.25 9,23 5,23 4.25,22.25 4.25,19.75 6.25,17.75 6.25,14.35 D2.A 8.1,11.2 7.81,10.91 R48.2 7.81,7.81 7.2,7.2 C48.C
  Bottom 0.25: v21.5,46 22.5,46 23.5,45 23.5,37.75 21,35.25 21,27.25 20.25,26.5 v14.5,26.5
A3V3  (via drill 0.25)
  Top 0.25: 11.47,47.19 C34.2 13,44.25 14.15,43.1 14.15,42.6 14.5,42.25 14.5,37 15.25,36.25 15.25,28.5 16,27.75 16,25 14,23 10.75,23 10,22.25 10,18.25 9.19,17.44 L1.2 | 11.47,47.19 10.81,47.19 9.19,48.81 C33.2 5.19,48.81 4.5,49.5 U4.4 4.5,51.75 5.25,52.5 v5.25,63.25 | U1.13 14,85.25 13.5,84.75 13.5,82.75 12.94,82.19 C12.2 C11.2 8.69,83 C10.A | C10.A 6.8,84.45 2.96,88.28 R4.2 2.96,96.25 3.2,96.48 3.2,98.49 H1-H4.10 | C10.A 6.8,81.7 7.72,80.78 U2.16 6.92,79.42 6.5,79 C18.2 | C18.2 7.44,77.31 8,76.75 16.5,76.75 18.5,74.75 C24.A 20.05,67.8 20.56,68.31 C23.2 22,69 22.31,69.31 C22.2 C21.2 24,72 25.5,70.5 v25.5,70.25 25.79,70.25 U3.12 | C18.2 5.31,77.31 4.5,76.5 4.5,71.5 | 4.5,71.5 5.27,71.5 H1-H4.16 | 4.5,71.5 3.65,71.5 H1-H4.20 | U3.18 25.75,65.5 v25.75,65.25 | U5.8 11.47,47.19
  Bottom 0.25: v25.5,70.25 25.75,70 v25.75,65.25 | v5.25,63.25 5.25,66.36 5.64,66.74 5.64,68.41 H1-H4.16
BRIGHT-ATT
  Top 0.25: U2.2 8.38,72.88 8.75,72.5 8.75,71 8.25,70.5 8.25,69.25 9,68.5 10.81,68.5 H1-H4.12
BRIGHT-CV  (via drill 0.25)
  Top 0.25: U1.14 14.5,84.75 v14.25,84.5 | v15.25,56.75 14.25,56.75 13,55.5 R17.2 C31.2 11.31,51.69 11.47,51.52 U5.1
  Bottom 0.25: v14.25,84.5 13.5,83.75 13.5,83 12,81.5 12,80 14.5,77.5 14.5,74.75 15.5,73.75 15.5,62 15.25,61.75 v15.25,56.75
BRIGHT-JACK
  Top 0.25: R10.1 11.31,60.94 5.75,66.5 5.75,68.48 H1-H4.18
BRIGHT-POT
  Top 0.25: U2.4 9.68,72.92 9.25,72.5 9.25,71 9.54,70.71 H1-H4.14
D3V3  (via drill 0.25)
  Top 0.25: U1.64 17.75,94.25 17.25,94.75 C2.2 18.31,95.69 v18.5,95.5 | C8.A 34.2,88.8 33.69,89.31 C6.2 C5.2 30.5,90.75 30,91.25 29,91.25 | U1.32 26.44,81.75 C13.2 27.19,79.56 27.75,79 30,79 31.25,80.25 C14.A | R6.2 R5.2 | C14.A 33.95,81.95 34.5,82.5 37.25,82.5 38.25,83.5 38.25,88.25 37.7,88.8 C8.A | U1.19 18.75,80.81 | 18.75,80.81 18.75,77.44 R5.2 | C15.2 18.75,80.81 | R5.2 21.69,76.5 23,76.5 v23.5,76 | v34.75,61 35.31,60.44 R11.2 36.8,59.5 38.5,57.8 JP1.1 | U7.2 U7.4 | U7.4 17.85,20.9 17.81,20.94 C44.2 15.56,20.94 15.5,21 C45.A 12.8,18.8 10.81,16.81 L1.1 | U7.4 20,22.75 20.5,23.25 v22.75,23.25 | C14.A 33.95,78.8 35.06,77.69 C16.2 C17.2 C19.2 35.75,75 35.25,74.5 35.25,72.75 v34.75,72.25 32.5,72.25 v31,70.75 | U1.48 29,91.25 | v29,92.5 29,91.25 | v36.5,102.5 R1.2 35.31,107.44 34,108.75 28.5,108.75 27.96,108.21 H5.1 | C8.A v36,93.5 | D1.2 32.1,45.8 32.9,45 v33.75,45 | U3.3 31,70.04 v31,70.75 | U3.5 30.29,70.75 v31,70.75
  Bottom 0.25: v23.5,76 24,75.5 25.5,75.5 26.5,74.5 27.75,74.5 30.75,71.5 30.75,71 v31,70.75 | v22.75,23.25 25.25,25.75 25.25,29.25 33.75,37.75 v33.75,45 33.75,47.5 34.75,48.5 34.75,57.75 35.25,58.25 35.25,58.75 34.75,59.25 v34.75,61 v34.75,72.25 | v29,92.5 28.5,92.5 27.75,91.75 27.25,91.75 23.5,95.5 v18.5,95.5 | v36.5,102.5 36,102 v36,93.5
DAMP-ATT  (via drill 0.25)
  Top 0.25: U2.13 9.68,78.42 v9.5,78.25
  Bottom 0.25: v9.5,78.25 9.5,71.6 8.25,70.35 8.25,68.48 H1-H4.15
DAMP-CV  (via drill 0.25)
  Top 0.25: U1.21 19.75,79.25 v20,79 | v1.75,55.5 R15.2 C29.2 2.69,52.19 2.55,52.05 U4.7
  Bottom 0.25: v20,79 19.25,79 18.75,78.5 18.75,78 19,77.75 19,56.5 16.5,54 8.5,54 8,53.5 3.75,53.5 v1.75,55.5
DAMP-JACK
  Top 0.25: R8.1 2.69,62.69 4.46,64.46 H1-H4.17
DAMP-POT
  Top 0.25: U2.5 10.32,71.67 10.95,71.05 12.6,71.05 13.35,70.3 13.35,68.5 H1-H4.11
EVEN-JACK  (via drill 0.25)
  Top 0.25: R22.2 15.19,48.06 v15.25,48
  Bottom 0.25: v15.25,48 16,47.25 16,35 12,31 7.75,31 7.25,30.5 6.19,30.5 H1-H4.28
EVEN-OUT  (via drill 0.25)
  Top 0.25: v23.75,59.25 22.75,59.25 22,60 19.25,60 18.2,58.95 C28.A | v23.25,64.25 23.75,64.75 24.29,64.75 U3.17
  Bottom 0.25: v23.25,64.25 23,64 23,61.75 24,60.75 24,59.5 v23.75,59.25
EVEN-SW  (via drill 0.25)
  Top 0.25: v22,44 22,44.5 22.5,45 23.81,45 R25.1
  Bottom 0.25: v22,44 19,44 17,42 17,34.5 12.5,30 8.25,30 8.23,30 H1-H4.26
FREQ-ATT  (via drill 0.25)
  Top 0.25: v9.5,94.5 10.8,95.8 10.8,98.49 H1-H4.2 | U2.1 7.17,73.58 v6.75,74
  Bottom 0.25: v6.75,74 4.25,74 2.75,75.5 2.75,79.25 3.75,80.25 3.75,80.75 3.25,81.25 3.25,94.5 4.25,95.5 5.25,95.5 5.75,96 8,96 v9.5,94.5
FREQ-CV  (via drill 0.25)
  Top 0.25: R32.2 C37.2 2.69,43.81 2.55,43.95 U4.8 2.55,46.3 v3,46.75 | U1.20 19.25,78.5 v19.5,78.25
  Bottom 0.25: v19.5,78.25 19.5,56.25 16.75,53.5 8.75,53.5 5.5,50.25 5.5,49.25 v3,46.75
FREQ-JACK  (via drill 0.25)
  Top 0.25: v1.5,71.25 0.5,70.25 0.5,37.25 1.25,36.5 R38.1
  Bottom 0.25: v1.5,71.25 1.75,71.5 1.75,95.25 3.2,96.7 3.2,98.51 H1-H4.8
FREQ-POT  (via drill 0.25)
  Top 0.25: U1.11 14.25,86.25 v13.75,86.75
  Bottom 0.25: v13.75,86.75 13.75,87.5 11.55,89.7 11.55,95.95 10.8,96.7 10.8,98.51 H1-H4.4
GND  (via drill 0.25)
  Top 0.25: 23.25,82.75 U1.28 23.25,80.75 | 22.25,80.75 U1.26 22.25,82.75 | U1.60 19.75,94.25 | 18.25,94.25 U1.63 18.25,92.25 | 16.75,85.75 U1.12 14.75,85.75 | U1.18 18.25,82.75 | 31.23,66.23 U3.26 29.21,68.25 U3.29 | U3.15 25.19,67.06 | U3.15 25.3,68.05 | 26.48,65.52 U3.19 28.5,67.54 U3.29 | U3.29 26.38,68.25 U3.15 | U3.4 U3.29
  other vias: 8.25,101.25 8.25,98.5 26.5,95.25 25,90.75 22,90.25 22,88.25 18,91.75 19.25,89 14.25,90 13.5,96 13,93.5 7.75,92.75 7.25,88.5 7.5,84.75 13,86 4.5,94 4.5,84.75 4.5,89.5 10.75,81.25 17,86.25 20.5,83 22.25,80 17.5,79.5 17.75,74.5 31.25,94 30,95.25 31.5,90.75 34.25,90 34,92.75 37.5,89.75 31.5,88.5 31.75,86.75 34,85.25 37.5,88 34,88 30,83.5 27.5,83 28.25,79.75 31.5,83 8,75.75 7.5,78.25 10.5,83 8.25,81.5 11.75,85 5,81.5 4.75,79.5 3.75,76.25 11.75,77.5 10.25,74.75 12.75,74.75 11.75,72.25 7.5,71.75 3.5,73 13.75,72.75 17.75,72 17.75,70 36,60.5 17.75,61.75 17,58.75 13.5,66.5 7.25,63.25 9.75,61 6.5,61 4,61 1.75,64 1.5,58.75 13.5,63.25 13,57.25 8.25,65.25 10.5,63 33.25,55 36,52.25 36,49.25 35.5,47.5 33.75,49 29.5,52 30.25,49.25 32.75,52 16.75,55.25 20.75,54.75 22.5,52 19.5,52 24.25,50.25 26,45.75 15,51.5 18,50 18,47.75 11,48.5 8.25,50.25 15,45.25 1.5,61.5 10.5,58.5 3.5,58.5 8.75,56.5 10.5,56.5 3.5,56.5 7,54.5 7,56.5 7,58.5 12.25,56.5 1.5,54.25 1.5,51 9.5,47.25 8.75,45.75 6.75,48 4.5,46.5 3.25,49 1.5,45 7,43.5 10.5,43.5 10.5,41.5 8.75,41.5 7,41.5 5.25,41.5 3.5,41.5 3.5,39.5 5.25,39.5 7,39.5 8.75,39.5 10.5,39.5 3.5,37.5 5.25,37.5 7,37.5 8.75,37.5 10.5,37.5 13,38.25 12.25,40.5 8.75,43.5 1.5,41.5 1.5,37.5 6.75,35 1.5,35.5 1.5,32.5 11.5,33.75 4,33.75 14.5,35.5 1.5,48 22.25,47.25 20,45 20,47 17.5,45.25 23.75,47.75 24.25,42.75 20.5,41 17.75,38.25 20,35.25 22.5,39.25 22.5,41 26,42.75 26,39.5 26,36.75 24,35 24.25,37.5 22,35 21,38 22,33.5 24,33.5 24,31.5 22,28 19.75,28.75 19.75,33.25 16.75,32.75 16.75,28.75 14.25,30.5 15.25,27.5 31.75,34.5 32.75,35.5 33.75,36.5 32.75,41.75 30,32 34,32 34,34.25 30,30.25 28,30.25 25.25,30.25 36.25,35.5 21,26 21,24.5 13.25,27.5 23,24.5 33,14.25 10.25,91.75 10.25,88.25 10,5 12.25,3.25 8,3.25 30,5 28.25,3.5 32.75,3.5 24.5,5 15.5,5 6.25,11.75 4.5,15.25 6.25,8.25 7,1 1,6 2.75,8 4.5,6.5 2.75,10.75 2.75,13.5 1,15.5 1,10.25 1.5,24.25 1.25,17.75 3.25,21 6,24.75 5,17.75 34,1 31.75,25 34.25,25 39,24.5 39,20.75 39,16.5 39,12.5 39,9.5 39,6 33.75,7.25 34.75,10.75 36,14.25 35.5,17.75 10.25,1 13.75,1 17,1 23,1 27,1 30.5,1 1,72.25 1,76.5 1,80 1,84.75 1,89 1,93.75 0.75,98.5 1,101.5 1,108 9,109.75 17,109.5 23,109.5 26.75,109.75 30.25,109.75 33.75,109.75 37.25,109.75 39.25,107.5 38.25,92.25 39,88.75 37,94.75 39,85.75 39.25,62 38.75,60.25 38.75,52.75 39,47.5 39,44.25 39,40.25 39,36.75 39,31.75 30,81 28.5,85.75 37.5,85.25 13,60 8.75,35.5 25.5,50 6,73 17.5,77.25 21.75,85.75 12.75,83.5 10.5,85.75 22.75,83.25 8.75,58.5 24.75,24.25 22,48.75 20.5,42.5 4.75,43.75 4.25,52.5 29.25,27.5 36.25,32.5 29.25,25 26.25,26.75 10.75,27.5 10.75,25 4.5,32.25 13.75,41.75 11.5,44.75 2.75,30 8.5,32.25 13.25,98.5 10.5,94.5 6.25,19.25 9.25,18.5 11.5,19 18.75,22.75 14.5,22.5 17.75,18 22.25,18 15.75,19.75 12.25,15.5 16,15.25 9.75,13 8,14.25 1,3.5 1.75,1.5 3.75,1 3.75,4.25 39,3.75 38.5,1.75 36.5,1 10.25,7.75 13.5,8 29.5,7.75 29.5,11.25 26,13.75 27,16.5 23.75,21 26,19 13.5,18 31.75,19.5 35.5,21 33.75,22.5 30,15.5 28.75,19.25 27.25,24 1,13 26,7.75 32.75,9 35.5,5 36.75,25 28.75,78.25 31.75,79.25 33.5,78 35.75,75.75 35.75,78.5 36,83.25 36.75,81.75 39,82.75 39,78.5 39.25,75.75 39.25,72.25 38.75,69 39.25,65.75 35.5,70.25 35.5,67.25 35.75,64 31.5,63 36,62 29.5,62.75 23.25,66.75 24,62.25 25.5,59.5 28.5,59.5 23.75,57 25.75,55.75 29,55.75 28,54.25 31.5,55.5 32,57.75 32,60.25 23.25,71 24.5,73 25.25,77 32.75,75.5 34,73.25 1,104.5 5.75,109.75 2.5,109.5 13,109.75 17.25,105.25 22.75,105.25 20,103.75 11.25,105.5 6.25,107.5 5,103.5 15.75,101 15.25,92 16.5,93.75 17.25,98.75 22.75,101.5 22.5,96.5 19,101 20.75,98.75 27.25,99.75 28.25,101.5 32.75,101.5 34.5,99.5 34.5,101.5 34.5,97.5 34.5,95.5 34.5,103.5 29,97.25 30.75,99.5 32.75,104.5 30,103.25 26.75,105 25.25,107.25 24.5,103.75 34.25,107 36.25,107 36.25,103.5 39.25,104 39.25,100.75 37,100.25 36.75,97.5 39.25,97.5 39.25,94.25 24.75,68.25 28.5,64.5 32.25,68.25 28.5,75.25 31.25,72.5 26,64.25 33,65.5 33.75,68.75 30.75,76.5
  pour Top (isolate 0.25): 0,110.5 40,110.5 40,0 0,0
  pour Bottom (isolate 0.25): 0,110.5 40,110.5 40,0 0,0
I2C-SCL  (via drill 0.25)
  Top 0.25: U1.29 23.75,76.75 24.25,76.25 24.25,75.75 v23.5,75 23,75.5 R5.1 | U3.28 31.87,67 v32.25,67
  Bottom 0.25: v23.5,75 25.25,75 26.25,74 27.5,74 30.25,71.25 30.25,68.75 32,67 v32.25,67
I2C-SDA  (via drill 0.25)
  Top 0.25: R6.1 23.5,73.75 v24,74.25 24.25,74.5 24.25,75 24.75,75.5 24.75,76.5 24.25,77 U1.30 | U3.27 31.91,66.25 v32,66.25
  Bottom 0.25: v24,74.25 24.25,74.5 25,74.5 26,73.5 27.25,73.5 29.75,71 29.75,68.5 v32,66.25
I2S-LRCK  (via drill 0.25)
  Top 0.25: U1.33 25.5,83.75 24.25,85 24.25,87 v25,87.75 | U3.9 26.75,71.41 v26.75,71.75 26.5,72 26.5,75.75 v27,76.25 | U3.11 25.25,71.5 v25.25,71.75
  Bottom 0.25: v25,87.75 24.25,87 24.25,86.5 24.75,86 24.75,85.25 25.25,84.75 25.25,78 v27,76.25 | v26.75,71.75 v25.25,71.75
I2S-SCK  (via drill 0.25)
  Top 0.25: U1.34 25.75,84.25 24.75,85.25 24.75,86.5 v25,86.75 | U3.7 29.75,71.62 v29.75,75.5
  Bottom 0.25: v25,86.75 25.75,87.5 26.25,87.5 26.75,87 26.75,79.25 29.75,76.25 v29.75,75.5
I2S-SIN  (via drill 0.25)
  Top 0.25: U1.35 26,84.75 25.25,85.5 25.25,86 v26,86.75 | U3.10 26,71.46 26,76.25 v27,77.25
  Bottom 0.25: v26,86.75 25.25,86 25.25,85.5 25.75,85 25.75,78.5 v27,77.25
I2S-SOUT  (via drill 0.25)
  Top 0.25: U1.36 26.25,85.25 26,85.5 v26,85.75 | U3.8 27.5,71.37 27.5,72 27,72.5 27,75.25 27.75,76 v27.75,76.75
  Bottom 0.25: v26,85.75 26.25,85.5 26.25,79 27.75,77.5 v27.75,76.75
IN  (via drill 0.25)
  Top 0.25: C42.A 21.8,32.05 22.25,32.5 v24.75,32.5 | U3.23 30.5,64.84 v30.5,64.5
  Bottom 0.25: v24.75,32.5 30,37.75 30,42.75 29.5,43.25 29.5,50.75 30.5,51.75 v30.5,64.5
IN-JACK  (via drill 0.25)
  Top 0.25: R45.1 18,24.5 18.5,24 v19,24
  Bottom 0.25: v19,24 9.23,24 H1-H4.25
IN-SW  (via drill 0.25)
  Top 0.25: R27.2 32.75,38.75 v32.5,38.5
  Bottom 0.25: v32.5,38.5 24,30 24,26.5 22.75,25.25 13.06,25.25 H1-H4.21
JTCK/SWCLK  (via drill 0.25)
  Top 0.25: U1.49 25.25,95 v25.5,95.25 | v24.25,96.75 24.75,97.25 24.75,100.75 29.23,105.23 H5.4
  Bottom 0.25: v24.25,96.75 24.25,96.25 25.25,95.25 v25.5,95.25
JTDI
  Top 0.25: U1.50 24.75,95.5 25.75,96.5 25.75,100.25 30.5,105 30.91,105 H5.8
JTDO/SWO
  Top 0.25: U1.55 22.25,94 22.5,94.25 23.75,94.25 24.25,94.75 24.25,95.75 25.25,96.75 25.25,100.5 30.5,105.75 H5.6
JTMS/SWDIO  (via drill 0.25)
  Top 0.25: U1.46 26.25,90.25 25.75,90.75 25.75,91.75 26.25,92.25 27.25,92.25 v27.5,92.5 | v23.5,96.25 23.5,97 24.25,97.75 24.25,101 27.96,104.71 H5.2
  Bottom 0.25: v23.5,96.25 27.25,92.5 v27.5,92.5
LED-MODE-GRN
  Top 0.25: R44.2 H1-H4.36
LED-MODE-RED
  Top 0.25: R43.2 31,29.31 H1-H4.38
LED-POLY-GRN
  Top 0.25: R42.2 29,29.85 H1-H4.40
LED-POLY-RED
  Top 0.25: R41.2 27,30.25 26.25,29.5 26.25,27.9 H1-H4.39
MUTE  (via drill 0.25)
  Top 0.25: U3.25 33.25,63.5 33.75,63.5 v34,63.75 | v34.5,58.5 36.75,58.5 37.5,57.75 37.5,56.75 37.75,56.5 JP1.2
  Bottom 0.25: v34.5,58.5 34.25,58.75 34.25,60.5 34,60.75 34,61.25 34.25,61.5 34.25,63.5 v34,63.75
MUX-ADDR-0  (via drill 0.25)
  Top 0.25: U1.59 20.25,92.25 v20,92 | U2.11 10.97,80.22 11.75,81 v13.25,81
  Bottom 0.25: v20,92 20,91.25 20.25,91 20.25,88.25 13.5,81.5 13.5,81.25 v13.25,81
MUX-ADDR-1  (via drill 0.25)
  Top 0.25: U1.58 v20.75,91.5 | U2.10 11.62,80.12 12,80.5 12.75,80.5 13,80.25 v13.75,80.25
  Bottom 0.25: v13.75,80.25 14,80.5 14,81.25 20.75,88 v20.75,91.5
MUX-ADDR-2  (via drill 0.25)
  Top 0.25: U1.57 21.25,92.25 v21.5,92 | U2.9 14.18,79.42 v14.25,79.5
  Bottom 0.25: v14.25,79.5 14.5,79.75 14.5,81 21.25,87.75 21.25,91 21.5,91.25 v21.5,92
MUXED-POTS  (via drill 0.25)
  Top 0.25: U1.9 19,87.25 20.25,86 v20.25,85.75 | v15.75,75.25 15.5,75.5 9.5,75.5 9.03,75.03 U2.3
  Bottom 0.25: v20.25,85.75 20,85.75 15,80.75 15,78.5 15.5,78 15.5,75.5 v15.75,75.25
N$1  (via drill 0.25)
  Top 0.25: R43.1 31,34.25 28,37.25 28,40.75 v28.25,41 | U1.8 19.25,87.75 20.5,86.5 v21,86.5 | v17.5,60.25 17.75,60.5 22.5,60.5 v22.75,60.25
  Bottom 0.25: v21,86.5 21,85.5 20.5,85 20,85 15.5,80.5 15.5,78.75 16,78.25 16,76 16.5,75.5 16.5,61.5 16.25,61.25 16.25,60.75 16.75,60.25 v17.5,60.25 | v22.75,60.25 22.5,60 22.5,56.5 28.5,50.5 28.5,42.75 29,42.25 29,41.75 v28.25,41
N$2
  Top 0.25: U7.3 25.35,15.1 25.75,15.5 R47.2 28.46,17.54 27.2,18.8 C46.A
N$3
  Top 0.25: D3.A 29.5,12.5 30.31,11.69 L3.1
N$4
  Top 0.25: L2.1 9.69,11.69 10.5,12.5 D2.C
N$5
  Top 0.25: R8.2 R12.2 R15.1 C29.1 3.5,52.69 3.5,52.25 3.2,51.95 U4.6
N$6  (via drill 0.25)
  Top 0.25: R44.1 33,34.25 28.5,38.75 28.5,40.25 29,40.75 29,41.25 v28.25,42 | U1.51 24.25,92.25 v24.5,92
  Bottom 0.25: v24.5,92 24.5,91.25 23.75,90.5 23.75,86.25 24.25,85.75 24.25,85 24.75,84.5 24.75,79.5 22,76.75 22,56.25 28,50.25 28,42.25 v28.25,42
N$7
  Top 0.25: U1.31 24.75,82.5 25,82.75 25.5,82.75 26,82.25 29.75,82.25 30.69,83.19 C9.2
N$8
  Top 0.25: C3.2 28.25,93.94 28.25,92.25 27.75,91.75 26.5,91.75 26.25,91.5 26.25,91 26.5,90.75 U1.47
N$9  (via drill 0.25)
  Top 0.25: R42.1 29,34.25 27.5,35.75 v27.5,41.5 | U1.52 v23.75,91.5
  Bottom 0.25: v23.75,91.5 23.25,91 23.25,86 23.75,85.5 23.75,84.75 24.25,84.25 24.25,79.75 21.5,77 21.5,56 27.5,50 v27.5,41.5
N$10  (via drill 0.25)
  Top 0.25: R41.1 27,41 v26.5,41.5 | U1.53 23.25,92.25 v23,92
  Bottom 0.25: v23,92 22.75,91.75 22.75,85.75 23.25,85.25 23.25,84.5 23.75,84 23.75,80 21,77.25 21,55.75 27,49.75 27,42 v26.5,41.5
N$11
  Top 0.25: U1.5 14,89.25 13.06,90.19 C4.1 10.56,90.19 10.2,90.55 X1.2
N$12
  Top 0.25: U1.6 14.5,88.75 12.44,86.69 C7.1 10.44,86.69 10.2,86.45 X1.1
N$13
  Top 0.25: R10.2 R14.2 R17.1 C31.1 9.69,52.31 10.82,51.17 U5.2
N$14
  Top 0.25: R40.2 R37.2 R34.1 C39.1 9.69,43.94 10.18,44.42 U5.6
N$15
  Top 0.25: R38.2 R35.2 R32.1 C37.1 3.5,43.31 3.5,43.75 3.2,44.05 U4.9
N$16
  Top 0.25: R9.2 R13.2 R16.1 C30.1 6.19,52.44 5.8,52.05 U4.2
N$17
  Top 0.25: R39.2 R36.2 R33.1 C38.1 6.19,43.56 5.8,43.95 U4.13
N$18
  Top 0.25: R21.2 R20.1 21.5,54.25 21.8,54.55 C28.C
N$19
  Top 0.25: C43.2 R46.2 R45.2 18,28.25 18.2,28.45 C42.C
N$20
  Top 0.25: R31.2 R30.1 21.5,38.75 21.8,38.45 C41.C
N$21
  Top 0.25: R18.2 35.31,54.31 35.6,54.6 Q1.1
N$22
  Top 0.25: C25.2 36.69,66.14 X2.2 37.3,66.95 34.5,69.75 32.12,69.75 U3.1
N$23
  Top 0.25: X2.1 36.69,71.05 | C20.2 36.69,71.05 | U3.2 32.71,71.05 36.69,71.05
N$24
  Top 0.25: C32.1 R19.1 19.69,52.81 20.32,52.17 20.32,51.19 | 20.32,51.19 R20.2 22.25,50.44 22.25,49.94 R23.2 | U6.6 20.32,51.19
N$25
  Top 0.25: R22.1 16.81,49.94 16.5,50.25 C32.2 R19.2 19.31,51.19 19.68,50.83 U6.7
N$26
  Top 0.25: C40.1 R29.1 19.44,40.19 19.68,40.42 19.68,41.81 | 19.68,41.81 R30.2 22.25,42.56 22.25,43.06 R25.2 | U6.2 19.68,41.81
N$27
  Top 0.25: C26.2 29.31,61.81 28.8,61.3 C27.A 27,65.34 U3.20
N$28
  Top 0.25: R7.2 33.04,63 U3.24
N$29
  Top 0.25: R24.1 16.81,43.06 16.5,42.75 C40.2 R29.2 18.5,42.35 19.02,42.88 U6.1
N$30
  Top 0.25: R4.1 6.04,96.47 5.75,96.75 5.75,98.52 H1-H4.6
N$100
  Top 0.25: L2.2 12.5,10 13.27,9.23 H7.2
  Bottom 0.25: H7.1 H7.2
N$101
  Top 0.25: L3.2 27.5,10 26.73,9.23 H7.10
  Bottom 0.25: H7.9 H7.10
NORM-PROBE  (via drill 0.25)
  Top 0.25: U1.39 v28.5,86.75 | R26.1 30.52,43.28 R27.1 R28.1 v35.5,46 35.05,46 34.3,46.75 D1.3
  Bottom 0.25: v28.5,86.75 28.75,86.75 36.75,78.75 36.75,47.25 v35.5,46
ODD-JACK  (via drill 0.25)
  Top 0.25: R24.2 15.19,43.06 v15.25,43
  Bottom 0.25: v15.25,43 15.5,42.75 15.5,35.25 11.75,31.5 7.5,31.5 7,31 6,31 5,30 3.85,30 3.2,29.35 3.2,27.49 H1-H4.27
ODD-OUT  (via drill 0.25)
  Top 0.25: C41.A 18.2,34.8 18.75,34.25 v24.75,34.25 | v22.75,65 23.25,65 23.5,65.25 24.09,65.25 U3.16
  Bottom 0.25: v22.75,65 22.5,64.75 22.5,61.5 23.5,60.5 23.5,60 23,59.5 23,56.75 29,50.75 29,43 29.5,42.5 29.5,38 25.75,34.25 v24.75,34.25
ODD-SW  (via drill 0.25)
  Top 0.25: R23.1 24.81,48.06 v24.75,48
  Bottom 0.25: v24.75,48 23.25,49.5 18.75,49.5 16.5,47.25 16.5,34.75 12.25,30.5 8,30.5 7.5,30 6.4,30 5.75,29.35 5.75,25.65 5.05,24.95 3.2,24.95 H1-H4.29
POS-ATT  (via drill 0.25)
  Top 0.25: U2.15 8.38,78.38 v8.5,78.25 | v15,56 15,55.25 13.25,53.5 13.25,51 13.5,50.75 v13.5,50.25 | v13.5,36.25 13.25,36 13.25,31.75 12.08,30.58 H1-H4.22
  Bottom 0.25: v8.5,78.25 9.25,79 12.25,79 14,77.25 14,74.5 15,73.5 15,62.25 14.75,62 14.75,57.25 14.5,57 14.5,56.5 v15,56 | v13.5,50.25 13.25,50 13.25,44.5 12.25,43.5 12.25,42.25 14.25,40.25 14.25,37.5 13.5,36.75 v13.5,36.25
POS-CV  (via drill 0.25)
  Top 0.25: R33.2 C38.2 7.81,44.69 7.42,45.08 U4.14 6.45,46.3 v6,46.75 | U1.23 20.75,80.75 v21,80.5
  Bottom 0.25: v21,80.5 21.25,80.25 21.25,78.25 20.5,77.5 20.5,55.75 17.25,52.5 9.75,52.5 8.75,51.5 7.5,51.5 6,50 v6,46.75
POS-JACK
  Top 0.25: R39.1 7.81,34.31 6.5,33 3.25,33 1.92,31.67 H1-H4.30
POS-POT  (via drill 0.25)
  Top 0.25: U2.12 10.32,78.42 v10.5,78.25 | v14.25,55.75 14.25,55.25 12.75,53.75 v12.75,50.5 | v12.75,36.75 12.75,31.98 H1-H4.24
  Bottom 0.25: v10.5,78.25 10.75,78.5 12,78.5 13.5,77 13.5,74.25 14.5,73.25 14.5,62.5 14.25,62.25 14.25,57.5 14,57.25 14,56 v14.25,55.75 | v12.75,50.5 12.75,44.75 11.75,43.75 11.75,42 13.75,40 13.75,37.75 v12.75,36.75
RESET  (via drill 0.25)
  Top 0.25: U1.7 16.5,88.25 16.75,88.5 16.75,91.5 15.25,93 15.25,98.75 v19,102.5 | R1.1 C1.2 | R1.1 33.69,105.22 H5.10 | R1.1 v32,102.5
  Bottom 0.25: v32,102.5 v19,102.5
RX
  Top 0.25: R3.1 36.25,96.5 36.52,96.23 H6.RX
RX1  (via drill 0.25)
  Top 0.25: U1.43 28.25,88.75 28.5,89 28.5,90.25 v28.75,90.5 | R3.2 v32,96.5
  Bottom 0.25: v28.75,90.5 29.5,91.25 29.75,91.25 29.88,91.38 32.25,93.75 32.25,96.25 v32,96.5
STRUCT-ATT  (via drill 0.25)
  Top 0.25: U2.14 9.03,80.22 v8.75,80.5 | v3,80.5 v6,80.5
  Bottom 0.25: v3,80.5 2.75,80.75 2.75,94.75 4,96 5,96 5.5,96.5 6.27,96.5 H1-H4.5 | v6,80.5 v8.75,80.5
STRUCT-CV  (via drill 0.25)
  Top 0.25: R16.2 C30.2 7.81,52.25 | 7.81,52.25 7.81,51.31 7.42,50.92 U4.1 | U1.22 20.25,80 v20.5,79.75 | v8.5,52.25 7.81,52.25
  Bottom 0.25: v20.5,79.75 20.75,79.5 20.75,78.5 20,77.75 20,56 17,53 9.25,53 v8.5,52.25
STRUCT-JACK  (via drill 0.25)
  Top 0.25: R9.1 7.81,60.94 v7,61.75
  Bottom 0.25: v7,61.75 4.7,61.75 3.2,63.25 3.2,70.3 2.25,71.25 2.25,95.02 H1-H4.7
STRUCT-POT  (via drill 0.25)
  Top 0.25: U1.10 14.75,86.75 14.5,87 v14.5,87.5
  Bottom 0.25: v14.5,87.5 12.08,89.92 H1-H4.1
STRUM  (via drill 0.25)
  Top 0.25: R11.1 33.69,58.19 33.4,57.9 Q1.3 31,56.5 30.75,56.5 29.25,55 25.5,55 24.5,56 24.5,59.5 23,61 v17,61 | U1.16 v19.75,83.75
  Bottom 0.25: v19.75,83.75 19.5,83.75 16,80.25 16,79 16.5,78.5 16.5,76.25 17,75.75 v17,61
STRUM-JACK
  Top 0.25: R18.1 33.69,50.56 36.75,47.5 36.75,46.5 37.25,46 37.25,32.5 34.25,29.5 34.25,27.48 H1-H4.35
STRUM-SW  (via drill 0.25)
  Top 0.25: R26.2 30.5,38.75 v33.75,35.5
  Bottom 0.25: v33.75,35.5 31.75,33.5 31.75,27.52 H1-H4.37
SW-MODE  (via drill 0.25)
  Top 0.25: v37.5,46.75 37.75,46.5 37.75,32.25 35.54,30.04 H1-H4.34 | U1.61 19.25,91.75 21.5,89.5 24.75,89.5 v25,89.75
  Bottom 0.25: v25,89.75 25.75,89.75 26,89.5 27.5,89.5 37.75,79.25 37.75,48.5 38.25,48 38.25,47.5 v37.5,46.75
SW-POLY  (via drill 0.25)
  Top 0.25: U1.62 18.75,91.5 21.25,89 v25.5,89 | v37.5,47.75 38.25,47 38.25,32 36.8,30.55 36.8,27.51 H1-H4.31
  Bottom 0.25: v25.5,89 27.25,89 37.25,79 37.25,48 v37.5,47.75
TX
  Top 0.25: R2.1 36.25,98.5 36.52,98.77 H6.TX
TX1  (via drill 0.25)
  Top 0.25: U1.42 28.5,88.25 29,88.75 29,89.75 v29.75,90.5 | R2.2 v32,98.5
  Bottom 0.25: v29.75,90.5 32.75,93.5 32.75,96.75 32,97.5 v32,98.5
V/OCT-CV  (via drill 0.25)
  Top 0.25: C39.2 11.31,43.94 10.82,44.42 U5.7 | R34.2 C39.2 | C39.2 v13,42.5 | U1.15 15,84.25 v14.25,83.5 | v15.75,55.75 15.75,55.25 13.75,53.25 13.75,51.5 v14,51.25
  Bottom 0.25: v14.25,83.5 14.25,83 12.5,81.25 12.5,80.25 15,77.75 15,75 16,74 16,61.75 15.75,61.5 15.75,57.25 16,57 16,56 v15.75,55.75 | v14,51.25 14,50.75 14.25,50.5 14.25,50 13.75,49.5 13.75,44.25 13,43.5 v13,42.5
V/OCT-JACK
  Top 0.25: R40.1 12.25,35.56 12.25,32.25 10,30 8.95,30 8.25,29.3 8.25,27.52 H1-H4.23
V/OCT-SW  (via drill 0.25)
  Top 0.25: R28.2 35.5,32.5 v35,32
  Bottom 0.25: v35,32 34.25,31.25 34.25,27.52 H1-H4.33

### Text on the board
tPlace: TD-URSE-D-MB / 2024-07-30 | H1 | H2 | 1 | 0 | H3 | H4
bPlace: SWD/JTAG | Board derived from / work by Émilie Gillet of / Mutable Instruments | POWER
tDocu: H1 | H2 | H3 | H4